# EAGLE design breakout.tst (EAGLE 5.06)
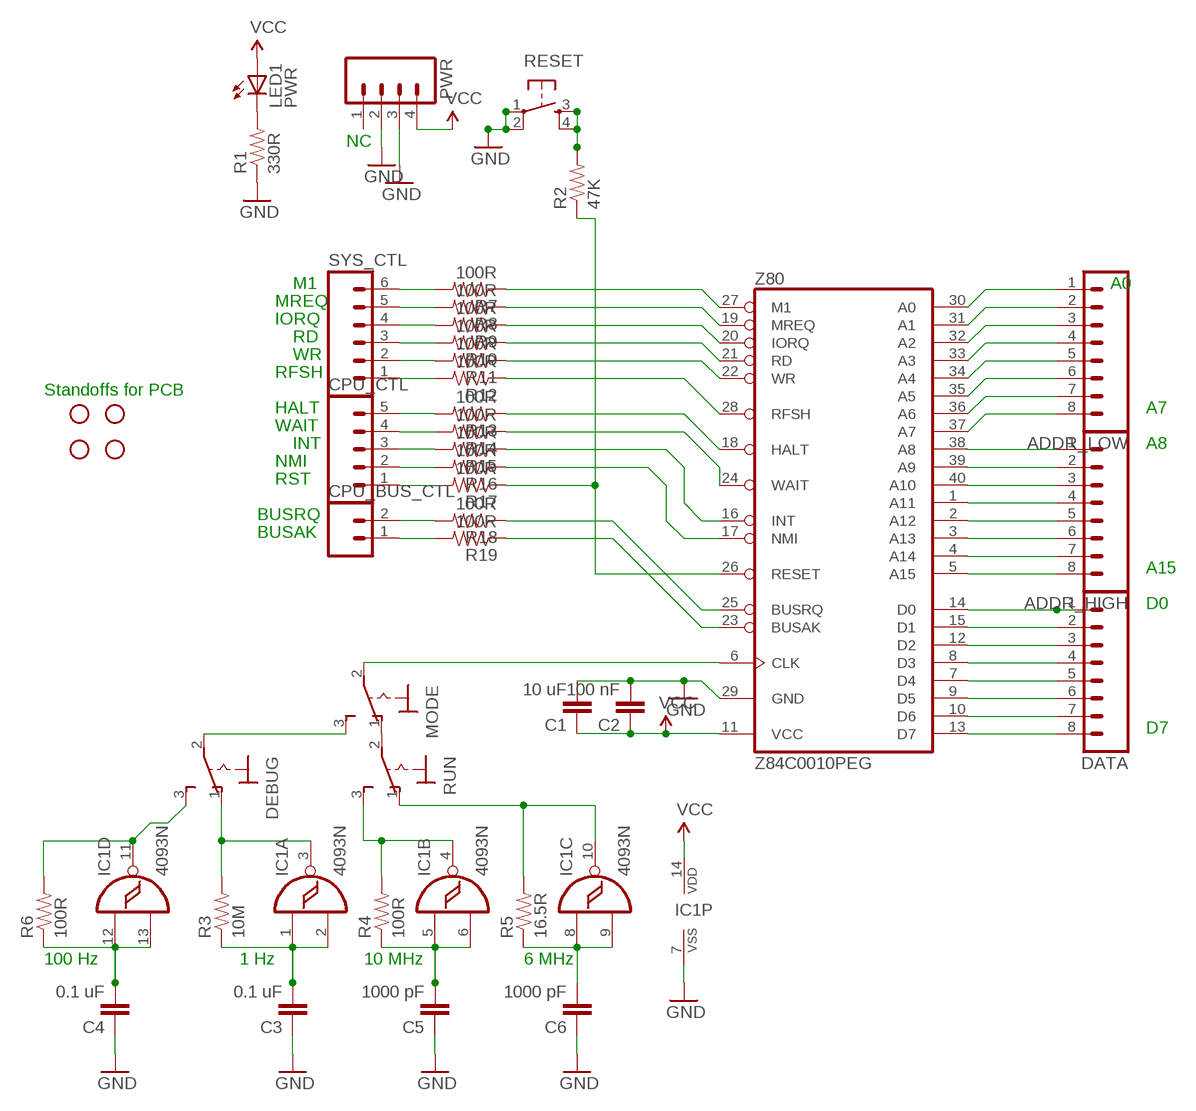
[diagram p0: schematic, sheet 1]

## Parts
ADDR_HIGH  M08  [1X08]
ADDR_LOW  M08  [1X08]
C1  10 uF  CAPPTH1  [CAP-PTH-5MM]
C2  100 nF  CAPPTH1  [CAP-PTH-5MM]
C3  0.1 uF  CAPPTH1  [CAP-PTH-5MM]
C4  0.1 uF  CAPPTH1  [CAP-PTH-5MM]
C5  1000 pF  CAPPTH1  [CAP-PTH-5MM]
C6  1000 pF  CAPPTH1  [CAP-PTH-5MM]
CPU_BUS_CTL  M02LOCK  [1X02_LOCK]
CPU_CTL  M05LOCK  [1X05_LOCK]
DATA  M08  [1X08]
DEBUG  320-916  [320-916]
IC1  4093N  [DIL14]
JP1  STAND-OFF  [STAND-OFF]
JP2  STAND-OFF  [STAND-OFF]
JP3  STAND-OFF  [STAND-OFF]
JP4  STAND-OFF  [STAND-OFF]
LED1  PWR  LED5MM  [LED5MM]
MODE  320-916  [320-916]
PWR  M04POLAR  [MOLEX-1X4]
R1  330R  RESISTORPTH1  [AXIAL-0.3]
R2  47K  RESISTORPTH1  [AXIAL-0.3]
R3  10M  RESISTORPTH1  [AXIAL-0.3]
R4  100R  RESISTORPTH1  [AXIAL-0.3]
R5  16.5R  RESISTORPTH1  [AXIAL-0.3]
R6  100R  RESISTORPTH1  [AXIAL-0.3]
R7  100R  RESISTORPTH1  [AXIAL-0.3]
R8  100R  RESISTORPTH1  [AXIAL-0.3]
R9  100R  RESISTORPTH1  [AXIAL-0.3]
R10  100R  RESISTORPTH1  [AXIAL-0.3]
R11  100R  RESISTORPTH1  [AXIAL-0.3]
R12  100R  RESISTORPTH1  [AXIAL-0.3]
R13  100R  RESISTORPTH1  [AXIAL-0.3]
R14  100R  RESISTORPTH1  [AXIAL-0.3]
R15  100R  RESISTORPTH1  [AXIAL-0.3]
R16  100R  RESISTORPTH1  [AXIAL-0.3]
R17  100R  RESISTORPTH1  [AXIAL-0.3]
R18  100R  RESISTORPTH1  [AXIAL-0.3]
R19  100R  RESISTORPTH1  [AXIAL-0.3]
RESET  TAC_SWITCH12MM  [TACTILE-PTH-12MM]
RUN  320-916  [320-916]
SYS_CTL  M06LOCK  [1X06_LOCK]
Z80  Z84C0010PEG  Z80CPU  [DIL40]

## Nets
GND: C1.2 C2.2 C3.1 C4.1 C5.1 C6.1 IC1.7(P:VSS) PWR.2 PWR.3 R1.P$1 RESET.1 RESET.2 Z80.29(GND)
N$1: ADDR_LOW.1 Z80.30(A0)
N$2: ADDR_LOW.2 Z80.31(A1)
N$3: ADDR_LOW.3 Z80.32(A2)
N$4: ADDR_LOW.4 Z80.33(A3)
N$5: ADDR_LOW.5 Z80.34(A4)
N$6: ADDR_LOW.6 Z80.35(A5)
N$7: ADDR_LOW.7 Z80.36(A6)
N$8: ADDR_LOW.8 Z80.37(A7)
N$9: ADDR_HIGH.1 Z80.38(A8)
N$10: ADDR_HIGH.2 Z80.39(A9)
N$11: ADDR_HIGH.3 Z80.40(A10)
N$12: ADDR_HIGH.4 Z80.1(A11)
N$13: LED1.K(C) R1.P$2
N$14: ADDR_HIGH.5 Z80.2(A12)
N$15: ADDR_HIGH.6 Z80.3(A13)
N$16: ADDR_HIGH.7 Z80.4(A14)
N$17: ADDR_HIGH.8 Z80.5(A15)
N$18: DATA.1 Z80.14(D0)
N$19: DATA.2 Z80.15(D1)
N$20: DATA.3 Z80.12(D2)
N$21: DATA.4 Z80.8(D3)
N$22: DATA.5 Z80.7(D4)
N$23: DATA.6 Z80.9(D5)
N$24: DATA.7 Z80.10(D6)
N$25: DATA.8 Z80.13(D7)
N$26: R2.P$1 R17.P$1 Z80.26(RESET)
N$27: R2.P$2 RESET.3 RESET.4
N$28: DEBUG.1(O) IC1.3(A:O) R3.P$2
N$29: C6.2 IC1.8(C:I0) IC1.9(C:I1) R5.P$1
N$30: C3.2 IC1.1(A:I0) IC1.2(A:I1) R3.P$1
N$31: C5.2 IC1.5(B:I0) IC1.6(B:I1) R4.P$1
N$32: IC1.4(B:O) R4.P$2 RUN.3(S)
N$33: MODE.2(P) Z80.6(CLK)
N$34: MODE.1(O) RUN.2(P)
N$35: IC1.10(C:O) R5.P$2 RUN.1(O)
N$36: DEBUG.2(P) MODE.3(S)
N$37: C4.2 IC1.12(D:I0) IC1.13(D:I1) R6.P$1
N$38: DEBUG.3(S) IC1.11(D:O) R6.P$2
N$39: R7.P$1 Z80.27(M1)
N$40: R8.P$1 Z80.19(MREQ)
N$41: R9.P$1 Z80.20(IORQ)
N$42: R10.P$1 Z80.21(RD)
N$43: R11.P$1 Z80.22(WR)
N$44: R12.P$1 Z80.28(RFSH)
N$45: R13.P$1 Z80.18(HALT)
N$46: R14.P$1 Z80.24(WAIT)
N$47: R15.P$1 Z80.16(INT)
N$48: R16.P$1 Z80.17(NMI)
N$49: R18.P$1 Z80.25(BUSRQ)
N$50: R19.P$1 Z80.23(BUSAK)
N$51: R7.P$2 SYS_CTL.6
N$52: R8.P$2 SYS_CTL.5
N$53: R9.P$2 SYS_CTL.4
N$54: R10.P$2 SYS_CTL.3
N$55: R11.P$2 SYS_CTL.2
N$56: R12.P$2 SYS_CTL.1
N$57: CPU_CTL.5 R13.P$2
N$58: CPU_CTL.4 R14.P$2
N$59: CPU_CTL.3 R15.P$2
N$60: CPU_CTL.2 R16.P$2
N$61: CPU_BUS_CTL.2 R18.P$2
N$62: CPU_BUS_CTL.1 R19.P$2
N$63: CPU_CTL.1 R17.P$2
VCC: C1.1 C2.1 IC1.14(P:VDD) LED1.A PWR.4 Z80.11(VCC)
Unconnected: PWR.1

## Notes on the sheet
- NC
- M1 | A0
- MREQ
- IORQ
- RD
- WR
- RFSH
- Standoffs for PCB
- HALT | A7
- WAIT
- INT | A8
- NMI
- RST
- BUSRQ
- BUSAK
- A15
- D0
- D7
- 100 Hz | 1 Hz | 10 MHz | 6 MHz

## Library data of the parts
ADDR_HIGH ADDR_LOW DATA = SparkFun:M08: Header 8 Standard 8-pin 0.1" header. Use with straight break away headers (SKU : PRT-00116), right angle break away headers (PRT-00553), swiss pins (PRT-00743), machine pins (PRT-00117), and female headers (PRT-00115).
C1-C6 = SparkFun:CAP: Capacitor Standard 0603 ceramic capacitor, and 0.1" leaded capacitor.
CPU_BUS_CTL = SparkFun:M02: Header 2 Standard 2-pin 0.1" header. Use with straight break away headers (SKU : PRT-00116), right angle break away headers (PRT-00553), swiss pins (PRT-00743), machine pins (PRT-00117), and female headers (PRT-00115). Molex polarized connector foot print use with SKU : PRT-08233 with associated crimp pins and housings.
CPU_CTL = SparkFun:M05: Header 5 Standard 5-pin 0.1" header. Use with straight break away headers (SKU : PRT-00116), right angle break away headers (PRT-00553), swiss pins (PRT-00743), machine pins (PRT-00117), and female headers (PRT-00115). Molex polarized connector foot print use with SKU : PRT-08230 with associated crimp pins and housings.
DEBUG MODE RUN = switch:320-916: TOGGLE SWITCH distributor RS Components
IC1 = 40xx:4093: Quad 2-input NAND schmitt trigger
JP1-JP4 = SparkFun:STAND-OFF: Stand Off This is the mechanical footprint for a #4 phillips button head screw. Use the keepout ring to avoid running the screw head into surrounding components. SKU : PRT-00447
LED1 = led:LED: LED OSRAM: - CHIPLED LG R971, LG N971, LY N971, LG Q971, LY Q971, LO R971, LY R971 LH N974, LH R974 LS Q976, LO Q976, LY Q976 LO Q996 - Hyper CHIPLED LW Q18S LB Q993, LB Q99A, LB R99A - SideLED LS A670, LO A670, LY A670, LG A670, LP A670 LB A673, LV A673, LT A673, LW A673 LH A674 LY A675 LS A676, LA A676, LO A676, LY A676, LW A676 LS A679, LY A679, LG A679 - Hyper Micro SIDELED® LS Y876, LA Y876, LO Y876, LY Y876 LT Y87S - SmartLED LW L88C, LW L88S LB L89C, LB L89S, LG L890 LS L89K, LO L89K, LY L89K LS L896, LA L896, LO L896, LY L896 - TOPLED LS T670, LO T670, LY T670, LG T670, LP T670 LSG T670, LSP T670, LSY T670, LOP T670, LYG T670 LG T671, LOG T671, LSG T671 LB T673, LV T673, LT T673, LW T673 LH T674 LS T676, LA T676, LO T676, LY T676, LB T676, LH T676, LSB T676, LW T676 LB T67C, LV T67C, LT T67C, LS T67K, LO T67K, LY T67K, LW E67C LS E67B, LA E67B, LO E67B, LY E67B, LB E67C, LV E67C, LT E67C LW T67C LS T679, LY T679, LG T679 LS T770, LO T770, LY T770, LG T770, LP T770 LB T773, LV T773, LT T773, LW T773 LH T774 LS E675, LA E675, LY E675, LS T675 LS T776, LA T776, LO T776, LY T776, LB T776 LHGB T686 LT T68C, LB T68C - Hyper Mini TOPLED® LB M676 - Mini TOPLED Santana® LG M470 LS M47K, LO M47K, LY M47K Source: http://www.osram.convergy.de LUXEON: - LUMILED® LXK2-PW12-R00, LXK2-PW12-S00, LXK2-PW14-U00, LXK2-PW14-V00 LXK2-PM12-R00, LXK2-PM12-S00, LXK2-PM14-U00 LXK2-PE12-Q00, LXK2-PE12-R00, LXK2-PE12-S00, LXK2-PE14-T00, LXK2-PE14-U00 LXK2-PB12-K00, LXK2-PB12-L00, LXK2-PB12-M00, LXK2-PB14-N00, LXK2-PB14-P00, LXK2-PB14-Q00 LXK2-PR12-L00, LXK2-PR12-M00, LXK2-PR14-Q00, LXK2-PR14-R00 LXK2-PD12-Q00, LXK2-PD12-R00, LXK2-PD12-S00 LXK2-PH12-R00, LXK2-PH12-S00 LXK2-PL12-P00, LXK2-PL12-Q00, LXK2-PL12-R00 Source: www.luxeon.com KINGBRIGHT: KA-3528ASYC Source: www.kingbright.com
PWR = SparkFun:M04: Header 4 Standard 4-pin 0.1" header. Use with straight break away headers (SKU : PRT-00116), right angle break away headers (PRT-00553), swiss pins (PRT-00743), machine pins (PRT-00117), and female headers (PRT-00115). Molex polarized connector foot print use with SKU : PRT-08231 with associated crimp pins and housings.
R1-R19 = SparkFun:RESISTOR: Resistor Basic schematic elements and footprints for 0603, 1206, and PTH 1/10th watt (small) resistors.
RESET = SparkFun:TAC_SWITCH: Momentary Switch Button commonly used for reset or general input. Spark Fun Electronics SKU : COM-00097
SYS_CTL = SparkFun:M06: Header 6 Standard 6-pin 0.1" header. Use with straight break away headers (SKU : PRT-00116), right angle break away headers (PRT-00553), swiss pins (PRT-00743), machine pins (PRT-00117), and female headers (PRT-00115). Molex polarized connector foot print use with SKU : PRT-08094 with associated crimp pins and housings. NOTES ON THE VARIANTS LOCK and LOCK_LONGPADS... This footprint was designed to help hold the alignment of a through-hole component (i.e. 6-pin header) while soldering it into place. You may notice that each hole has been shifted either up or down by 0.005 of an inch from it's more standard position (which is a perfectly straight line). This slight alteration caused the pins (the squares in the middle) to touch the edges of the holes. Because they are alternating, it causes a "brace" to hold the component in place. 0.005 has proven to be the perfect amount of "off-center" position when using our standard breakaway headers. Although looks a little odd when you look at the bare footprint, once you have a header in there, the alteration is very hard to notice. Also, if you push a header all the way into place, it is covered up entirely on the bottom side. This idea of altering the position of holes to aid alignment will be further integrated into the Sparkfun Library for other footprints. It can help hold any component with 3 or more connection pins.
Z80 = zilog:Z80CPU: Z80 FAMILY DEVICE

## Board
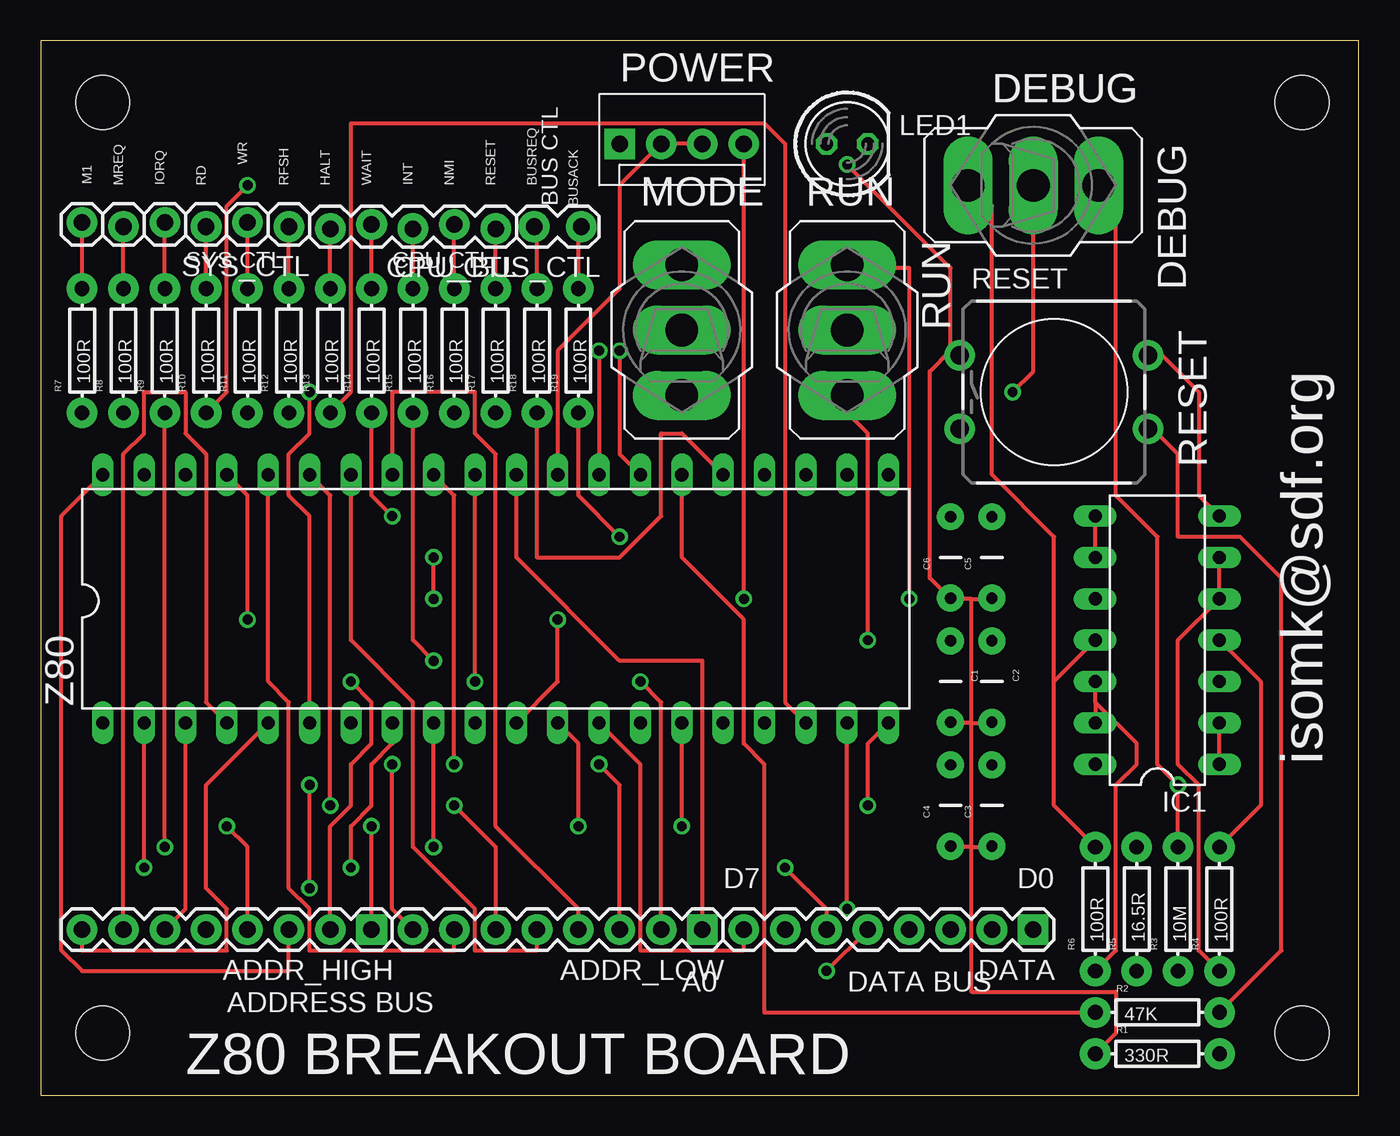
[diagram p1: board, top side]
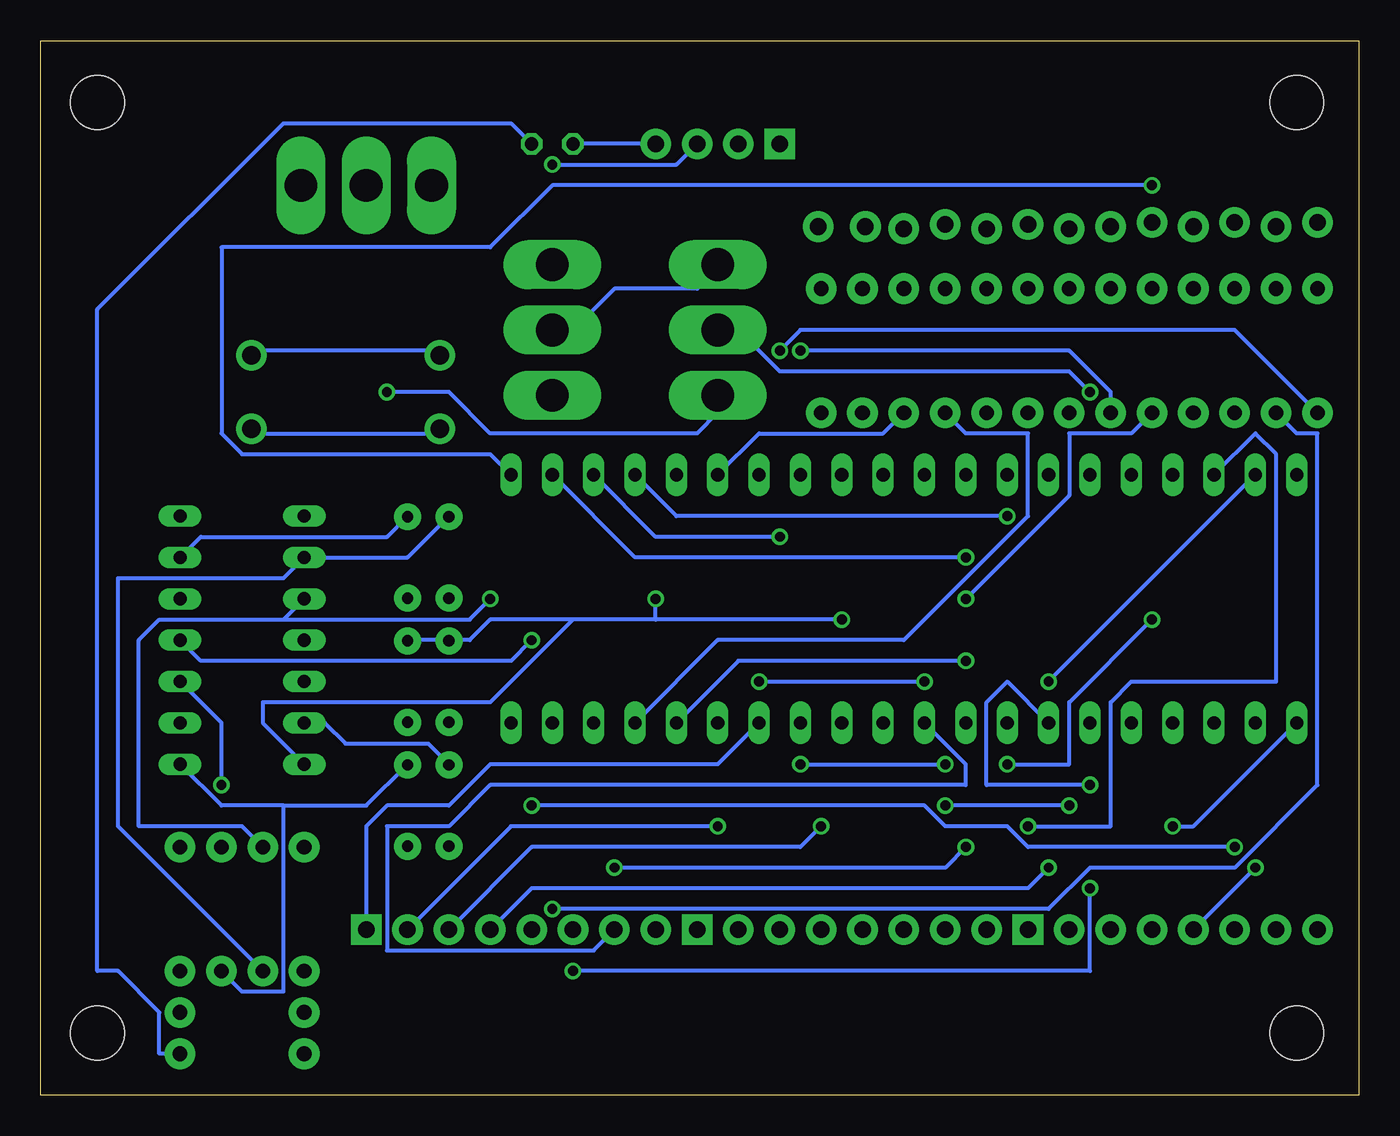
[diagram p2: board, bottom side, seen from below]

Size 80.95 x 64.76 mm. Coordinates in mm from the lower left corner, seen from the top.
Outline: 0,0 80.95,0 80.95,64.76 0,64.76 0,0
Copper layers (1*16): Top 0.035mm / dielectric 1.5mm / Bottom 0.035mm
Design rules "default": minimum track width 10mil, minimum drill 24mil, track to track 8mil, track to pad 8mil, pad to pad 8mil, via to via 8mil, smd to smd 8mil, copper to edge 40mil, drill to drill 8mil, minimum pad ring 10mil, minimum via ring 8mil, stop-mask expansion 4mil, vias tented up to drill 0mil, thermal gap 10mil

### Footprints (pad centres in the part's own frame; a part is rotated, then mirrored left to right if it is on the bottom)
1X08 = drill 1.016 pad 1.88 square: 1 0,0 | drill 1.016 pad 1.88 round: 2 2.54,0; 3 5.08,0; 4 7.62,0; 5 10.16,0; 6 12.7,0; 7 15.24,0; 8 17.78,0
CAP-PTH-5MM = drill 0.7 pad 1.651 round: 1 -2.5,0; 2 2.5,0
1X02_LOCK = drill 1.016 pad 1.88 round: 1 -0.178,0; 2 2.718,0
1X05_LOCK = drill 1.016 pad 1.88 round: 1 0,0.127; 2 2.54,-0.127; 3 5.08,0.127; 4 7.62,-0.127; 5 10.16,0.127
320-916 = drill 2.007 long: 1 0,4.013; 2 0,0; 3 0,-4.013
DIL14 = drill 0.813 long: 1 -7.62,-3.81; 2 -5.08,-3.81; 3 -2.54,-3.81; 4 0,-3.81; 5 2.54,-3.81; 6 5.08,-3.81; 7 7.62,-3.81; 8 7.62,3.81; 9 5.08,3.81; 10 2.54,3.81; 11 0,3.81; 12 -2.54,3.81; 13 -5.08,3.81; 14 -7.62,3.81
STAND-OFF = hole 3.302: 0,0
LED5MM = drill 0.813 octagon: A -1.27,0; K 1.27,0
MOLEX-1X4 = drill 1.016 pad 1.88 square: 1 0,0 | drill 1.016 pad 1.88 round: 2 2.54,0; 3 5.08,0; 4 7.62,0
AXIAL-0.3 = drill 0.9 pad 1.88 round: P$1 -3.81,0; P$2 3.81,0
TACTILE-PTH-12MM = drill 1.143 pad 1.88 round: 1 -5.791,2.261; 2 5.791,2.261; 3 -5.791,-2.261; 4 5.791,-2.261
1X06_LOCK = drill 1.016 pad 1.88 round: 1 0,0; 2 2.54,-0.254; 3 5.08,0; 4 7.62,-0.254; 5 10.16,0; 6 12.7,-0.254
DIL40 = drill 0.813 long: 1 -24.13,-7.62; 2 -21.59,-7.62; 3 -19.05,-7.62; 4 -16.51,-7.62; 5 -13.97,-7.62; 6 -11.43,-7.62; 7 -8.89,-7.62; 8 -6.35,-7.62; 9 -3.81,-7.62; 10 -1.27,-7.62; 11 1.27,-7.62; 12 3.81,-7.62; 13 6.35,-7.62; 14 8.89,-7.62; 15 11.43,-7.62; 16 13.97,-7.62; 17 16.51,-7.62; 18 19.05,-7.62; 19 21.59,-7.62; 20 24.13,-7.62; 21 24.13,7.62; 22 21.59,7.62; 23 19.05,7.62; 24 16.51,7.62; 25 13.97,7.62; 26 11.43,7.62; 27 8.89,7.62; 28 6.35,7.62; 29 3.81,7.62; 30 1.27,7.62; 31 -1.27,7.62; 32 -3.81,7.62; 33 -6.35,7.62; 34 -8.89,7.62; 35 -11.43,7.62; 36 -13.97,7.62; 37 -16.51,7.62; 38 -19.05,7.62; 39 -21.59,7.62; 40 -24.13,7.62

### Placement (x,y rotation side)
ADDR_HIGH  20.32,10.16 180 top
ADDR_LOW  40.64,10.16 180 top
C1  55.88,25.4 270 top
C2  58.42,25.4 270 top
C3  58.42,17.78 90 top
C4  55.88,17.78 90 top
C5  58.42,33.02 90 top
C6  55.88,33.02 90 top
CPU_BUS_CTL  33.02,53.34 180 top
CPU_CTL  27.94,53.34 180 top
DATA  60.96,10.16 180 top
DEBUG  60.96,55.88 270 top
IC1  68.58,27.94 90 top
JP1  77.47,3.81 0 top
JP2  77.47,60.96 0 top
JP3  3.81,3.81 0 top
JP4  3.81,60.96 0 top
LED1  49.53,58.42 0 top
MODE  39.37,46.99 0 top
PWR  35.56,58.42 0 top
R1  68.58,2.54 0 top
R2  68.58,5.08 0 top
R3  69.85,11.43 90 top
R4  72.39,11.43 90 top
R5  67.31,11.43 90 top
R6  64.77,11.43 90 top
R7  2.54,45.72 90 top
R8  5.08,45.72 90 top
R9  7.62,45.72 90 top
R10  10.16,45.72 90 top
R11  12.7,45.72 90 top
R12  15.24,45.72 90 top
R13  17.78,45.72 90 top
R14  20.32,45.72 90 top
R15  22.86,45.72 90 top
R16  25.4,45.72 90 top
R17  27.94,45.72 90 top
R18  30.48,45.72 90 top
R19  33.02,45.72 90 top
RESET  62.23,43.18 0 top
RUN  49.53,46.99 0 top
SYS_CTL  15.24,53.34 180 top
Z80  27.94,30.48 0 top

### Tracks (layer width: path | path; a pad name or v marks a point on that pad's centre or on a via)
GND  (via drill 0.61)
  Top 0.254: Z80.29 31.75,45.72 35.56,49.53 35.56,55.88 PWR.2 PWR.3 | IC1.7 71.12,36.83 71.12,43.18 68.58,45.72 RESET.2 | 57.15,22.86 58.42,22.86 C2.2 | 57.15,22.86 55.88,22.86 C1.2 | 57.15,30.48 58.42,30.48 C5.1 | 57.15,30.48 55.88,30.48 | 57.15,22.86 57.15,30.48 | 57.15,15.24 58.42,15.24 C3.1 | 57.15,15.24 55.88,15.24 C4.1 | R1.P$1 66.04,3.81 66.04,6.35 57.15,6.35 57.15,15.24 | 57.15,15.24 57.15,22.86 | 55.88,45.72 54.61,44.45 54.61,31.75 55.88,30.48 | 55.88,30.48 C6.1 | v49.53,57.15 55.88,50.8 55.88,45.72 | 55.88,45.72 RESET.1
  Bottom 0.254: RESET.1 57.15,45.72 67.31,45.72 RESET.2 | PWR.3 41.91,57.15 v49.53,57.15
N$1
  Top 0.254: Z80.30 29.21,33.02 35.56,26.67 40.64,26.67 ADDR_LOW.1
N$2  (via drill 0.61)
  Top 0.254: v26.67,25.4 Z80.31 | v36.83,25.4 38.1,24.13 ADDR_LOW.2
  Bottom 0.254: v36.83,25.4 v26.67,25.4
N$3  (via drill 0.61)
  Top 0.254: Z80.32 25.4,36.83 v25.4,20.32 | v34.29,20.32 35.56,19.05 ADDR_LOW.3
  Bottom 0.254: v34.29,20.32 v25.4,20.32
N$4
  Top 0.254: Z80.33 21.59,43.18 26.67,43.18 26.67,40.64 27.94,39.37 27.94,16.51 33.02,11.43 ADDR_LOW.4
N$5
  Top 0.254: Z80.34 19.05,27.94 22.86,24.13 22.86,15.24 26.67,11.43 26.67,8.89 30.48,8.89 ADDR_LOW.5
N$6  (via drill 0.61)
  Top 0.254: Z80.35 17.78,36.83 v17.78,17.78 | v25.4,17.78 27.94,15.24 ADDR_LOW.6
  Bottom 0.254: v17.78,17.78 v25.4,17.78
N$7
  Top 0.254: Z80.36 13.97,25.4 15.24,24.13 15.24,12.7 16.51,11.43 16.51,8.89 25.4,8.89 ADDR_LOW.7
N$8  (via drill 0.61)
  Top 0.254: Z80.37 12.7,36.83 v12.7,29.21 | v21.59,20.32 21.59,11.43 ADDR_LOW.8
  Bottom 0.254: v12.7,29.21 17.78,24.13 17.78,20.32 v21.59,20.32
N$9  (via drill 0.61)
  Top 0.254: ADDR_HIGH.1 v20.32,16.51
  Bottom 0.254: Z80.38 6.35,40.64 5.08,39.37 5.08,25.4 13.97,25.4 15.24,24.13 15.24,16.51 v20.32,16.51
N$10  (via drill 0.61)
  Top 0.254: v19.05,25.4 20.32,24.13 20.32,21.59 19.05,20.32 19.05,17.78 17.78,16.51 ADDR_HIGH.2
  Bottom 0.254: v19.05,25.4 Z80.39
N$11
  Top 0.254: Z80.40 1.27,35.56 1.27,8.89 2.54,7.62 15.24,7.62 ADDR_HIGH.3
N$12  (via drill 0.61)
  Top 0.254: v11.43,16.51 12.7,15.24 ADDR_HIGH.4
  Bottom 0.254: Z80.1 10.16,16.51 v11.43,16.51
N$13
  Bottom 0.254: LED1.K 52.07,59.69 66.04,59.69 77.47,48.26 77.47,7.62 76.2,7.62 73.66,5.08 73.66,2.54 R1.P$2
N$14  (via drill 0.61)
  Top 0.254: v6.35,13.97 Z80.2
  Bottom 0.254: v6.35,13.97 ADDR_HIGH.5
N$15
  Top 0.254: Z80.3 8.89,11.43 ADDR_HIGH.6
N$16
  Top 0.254: Z80.4 10.16,24.13 10.16,39.37 8.89,40.64 8.89,43.18 6.35,43.18 6.35,40.64 5.08,39.37 ADDR_HIGH.7
N$17
  Top 0.254: Z80.5 10.16,19.05 10.16,12.7 11.43,11.43 11.43,8.89 2.54,8.89 ADDR_HIGH.8
N$18
  Bottom 0.254: Z80.14 39.37,20.32 53.34,20.32 55.88,17.78 59.69,17.78 60.96,16.51 DATA.1
N$19  (via drill 0.61)
  Top 0.254: v39.37,16.51 Z80.15
  Bottom 0.254: v39.37,16.51 52.07,16.51 DATA.2
N$20  (via drill 0.61)
  Top 0.254: Z80.12 33.02,21.59 v33.02,16.51
  Bottom 0.254: v33.02,16.51 34.29,15.24 50.8,15.24 DATA.3
N$21  (via drill 0.61)
  Top 0.254: Z80.8 21.59,21.59 20.32,20.32 20.32,17.78 19.05,16.51 v19.05,13.97
  Bottom 0.254: v19.05,13.97 20.32,12.7 50.8,12.7 DATA.4
N$22  (via drill 0.61)
  Top 0.254: v16.51,12.7 v16.51,19.05 | v48.26,7.62 DATA.5
  Bottom 0.254: Z80.7 21.59,25.4 22.86,24.13 22.86,19.05 v16.51,19.05 | v16.51,12.7 16.51,7.62 v48.26,7.62
N$23  (via drill 0.61)
  Top 0.254: v24.13,15.24 Z80.9 | v45.72,13.97 48.26,11.43 DATA.6
  Bottom 0.254: v24.13,15.24 25.4,13.97 v45.72,13.97
N$24
  Bottom 0.254: Z80.10 24.13,20.32 24.13,19.05 53.34,19.05 55.88,16.51 59.69,16.51 59.69,8.89 46.99,8.89 DATA.7
N$25
  Top 0.254: Z80.13 36.83,20.32 36.83,8.89 43.18,8.89 DATA.8
N$26
  Top 0.254: R2.P$1 44.45,5.08 44.45,20.32 43.18,21.59 43.18,29.21 39.37,33.02 Z80.26
  Bottom 0.254: Z80.26 36.83,40.64 29.21,40.64 R17.P$1
N$27
  Top 0.254: R2.P$2 76.2,8.89 76.2,31.75 73.66,34.29 69.85,34.29 69.85,39.37 68.58,40.64 RESET.4
  Bottom 0.254: RESET.3 57.15,40.64 67.31,40.64 RESET.4
N$28  (via drill 0.61)
  Top 0.254: R3.P$2 v69.85,19.05 68.58,20.32 68.58,34.29 66.04,36.83 66.04,55.88 DEBUG.1
  Bottom 0.254: IC1.3 69.85,22.86 v69.85,19.05
N$29
  Top 0.254: IC1.9 IC1.8
  Bottom 0.254: C6.2 55.88,35.56 58.42,33.02 IC1.9 66.04,31.75 76.2,31.75 76.2,16.51 R5.P$1
N$30
  Top 0.254: IC1.1 IC1.2
  Bottom 0.254: 66.04,17.78 69.85,17.78 IC1.1 | 66.04,17.78 60.96,17.78 58.42,20.32 C3.2 | R3.P$1 68.58,6.35 66.04,6.35 66.04,17.78
N$31
  Top 0.254: IC1.6 IC1.5 69.85,27.94 69.85,20.32 71.12,19.05 71.12,8.89 R4.P$1
  Bottom 0.254: IC1.6 71.12,34.29 59.69,34.29 58.42,35.56 C5.2
N$32  (via drill 0.61)
  Top 0.254: IC1.4 74.93,25.4 74.93,17.78 R4.P$2 | v50.8,27.94 50.8,40.64 49.53,41.91 RUN.3
  Bottom 0.254: v50.8,27.94 52.07,26.67 71.12,26.67 IC1.4
N$33  (via drill 0.61)
  Top 0.254: Z80.6 16.51,35.56 15.24,36.83 15.24,39.37 16.51,40.64 v16.51,43.18
  Bottom 0.254: v16.51,43.18 17.78,44.45 35.56,44.45 38.1,46.99 MODE.2
N$34
  Bottom 0.254: RUN.2 48.26,46.99 45.72,49.53 40.64,49.53 39.37,50.8 MODE.1
N$35  (via drill 0.61)
  Top 0.254: v53.34,30.48 53.34,50.8 49.53,50.8 RUN.1
  Bottom 0.254: 66.04,29.21 IC1.10 | 66.04,29.21 73.66,29.21 74.93,27.94 74.93,16.51 68.58,16.51 R5.P$2 | v53.34,30.48 54.61,29.21 66.04,29.21
N$36  (via drill 0.61)
  Top 0.254: v59.69,43.18 60.96,44.45 DEBUG.2
  Bottom 0.254: v59.69,43.18 55.88,43.18 53.34,40.64 40.64,40.64 39.37,41.91 MODE.3
N$37
  Top 0.254: 64.77,24.13 IC1.12 | 64.77,24.13 IC1.13 | R6.P$1 66.04,8.89 66.04,19.05 67.31,20.32 67.31,21.59 64.77,24.13
  Bottom 0.254: IC1.13 63.5,22.86 62.23,21.59 57.15,21.59 55.88,20.32 C4.2
N$38
  Top 0.254: 62.23,25.4 IC1.11 | 62.23,25.4 62.23,17.78 R6.P$2 | 62.23,25.4 62.23,34.29 58.42,38.1 58.42,54.61 57.15,55.88 DEBUG.3
N$39  (via drill 0.61)
  Top 0.254: Z80.27 35.56,39.37 v35.56,45.72
  Bottom 0.254: v35.56,45.72 34.29,46.99 7.62,46.99 R7.P$1
N$40  (via drill 0.61)
  Top 0.254: v49.53,11.43 Z80.19
  Bottom 0.254: v49.53,11.43 19.05,11.43 16.51,13.97 7.62,13.97 2.54,19.05 2.54,40.64 3.81,40.64 R8.P$1
N$41  (via drill 0.61)
  Top 0.254: Z80.20 50.8,21.59 v50.8,17.78 | v7.62,15.24 R9.P$1
  Bottom 0.254: v50.8,17.78 26.67,17.78 25.4,16.51 21.59,16.51 20.32,15.24 v7.62,15.24
N$42  (via drill 0.61)
  Top 0.254: v12.7,55.88 11.43,54.61 11.43,43.18 R10.P$1
  Bottom 0.254: Z80.21 53.34,39.37 68.58,39.37 69.85,40.64 69.85,52.07 53.34,52.07 49.53,55.88 v12.7,55.88
N$43  (via drill 0.61)
  Top 0.254: v24.13,30.48 v24.13,33.02
  Bottom 0.254: Z80.22 44.45,33.02 v24.13,33.02 | v24.13,30.48 17.78,36.83 17.78,40.64 13.97,40.64 R11.P$1
N$44  (via drill 0.61)
  Top 0.254: v34.29,45.72 Z80.28
  Bottom 0.254: v34.29,45.72 17.78,45.72 15.24,43.18 R12.P$1
N$45
  Top 0.254: Z80.18 45.72,24.13 45.72,58.42 44.45,59.69 19.05,59.69 19.05,43.18 R13.P$1
N$46  (via drill 0.61)
  Top 0.254: v21.59,35.56 20.32,36.83 R14.P$1
  Bottom 0.254: Z80.24 41.91,35.56 v21.59,35.56
N$47  (via drill 0.61)
  Top 0.254: v24.13,26.67 22.86,27.94 R15.P$1
  Bottom 0.254: Z80.16 38.1,26.67 v24.13,26.67
N$48
  Bottom 0.254: Z80.17 39.37,27.94 27.94,27.94 20.32,35.56 20.32,40.64 24.13,40.64 R16.P$1
N$49
  Top 0.254: Z80.25 39.37,40.64 38.1,40.64 38.1,35.56 35.56,33.02 30.48,33.02 R18.P$1
N$50  (via drill 0.61)
  Top 0.254: v35.56,34.29 33.02,36.83 R19.P$1
  Bottom 0.254: Z80.23 43.18,34.29 v35.56,34.29
N$51
  Top 0.254: R7.P$2 SYS_CTL.6
N$52
  Top 0.254: R8.P$2 SYS_CTL.5
N$53
  Top 0.254: R9.P$2 SYS_CTL.4
N$54
  Top 0.254: R10.P$2 SYS_CTL.3
N$55
  Top 0.254: R11.P$2 SYS_CTL.2
N$56
  Top 0.254: R12.P$2 SYS_CTL.1
N$57
  Top 0.254: R13.P$2 CPU_CTL.5 17.78,53.34
N$58
  Top 0.254: R14.P$2 CPU_CTL.4
N$59
  Top 0.254: R15.P$2 CPU_CTL.3 22.86,53.34
N$60
  Top 0.254: R16.P$2 CPU_CTL.2
N$61
  Top 0.254: R18.P$2 30.48,53.34 CPU_BUS_CTL.2
N$62
  Top 0.254: R19.P$2 33.02,53.34 CPU_BUS_CTL.1
N$63
  Top 0.254: R17.P$2 CPU_CTL.1 27.94,53.34
VCC  (via drill 0.61)
  Top 0.254: Z80.11 31.75,25.4 v31.75,29.21 | v43.18,30.48 PWR.4
  Bottom 0.254: PWR.4 LED1.A | 48.26,29.21 53.34,29.21 54.61,27.94 55.88,27.94 | 43.18,29.21 48.26,29.21 | v31.75,29.21 43.18,29.21 | IC1.14 67.31,22.86 67.31,24.13 53.34,24.13 48.26,29.21 | 55.88,27.94 58.42,27.94 C2.1 | 55.88,27.94 C1.1 | 43.18,29.21 v43.18,30.48

### Text on the board
tPlace: POWER | DEBUG | DEBUG | M1 | WR | MREQ | IORQ | RD | RFSH | HALT | WAIT | INT | NMI | RESET | BUSREQ | BUS CTL | BUSACK | MODE | SYS CTL | CPU CTL | RUN | RESET | isomk@sdf.org | D0 | D7 | A0 | DATA BUS | ADDRESS BUS | Z80 BREAKOUT BOARD